# Altium schematic sheet GroundtoFrame.SchDoc
size B
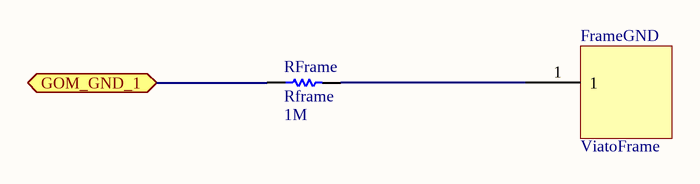
[diagram p0: GroundtoFrame.SchDoc]

## Parts
FrameGND  ViatoFrame  [ViatoFrame]
RFrame  Rframe  value 1M  [AXIAL-0.3]

## Ports
GOM_GND_1 (bidir)

## Nets
GOM_GND_1: RFrame.1 ; port GOM_GND_1
NetFrameGND_1: FrameGND.1 RFrame.2

## Library data of the parts
RFrame = Res1: Resistor -  CF14JT1M00CT-ND; Published: 8-Jun-2000; LatestRevisionDate: 17-Jul-2002; LatestRevisionNote: Re-released for DXP Platform.; PackageReference: AXIAL-0.3; Publisher: Altium Limited; PackageDescription: Axial Device, Thru-Hole; 2 Leads; 0.3 in Pin Spacing